# EasyEDA schematic SCH_Padauk_breakout_sop8_2023-01-24.json
TITLE: EZ PDK8; REV: 1.0; Date: 2023-01-24; Sheet: 1/1; Drawn By: Cjacker; Company: TEAM A72
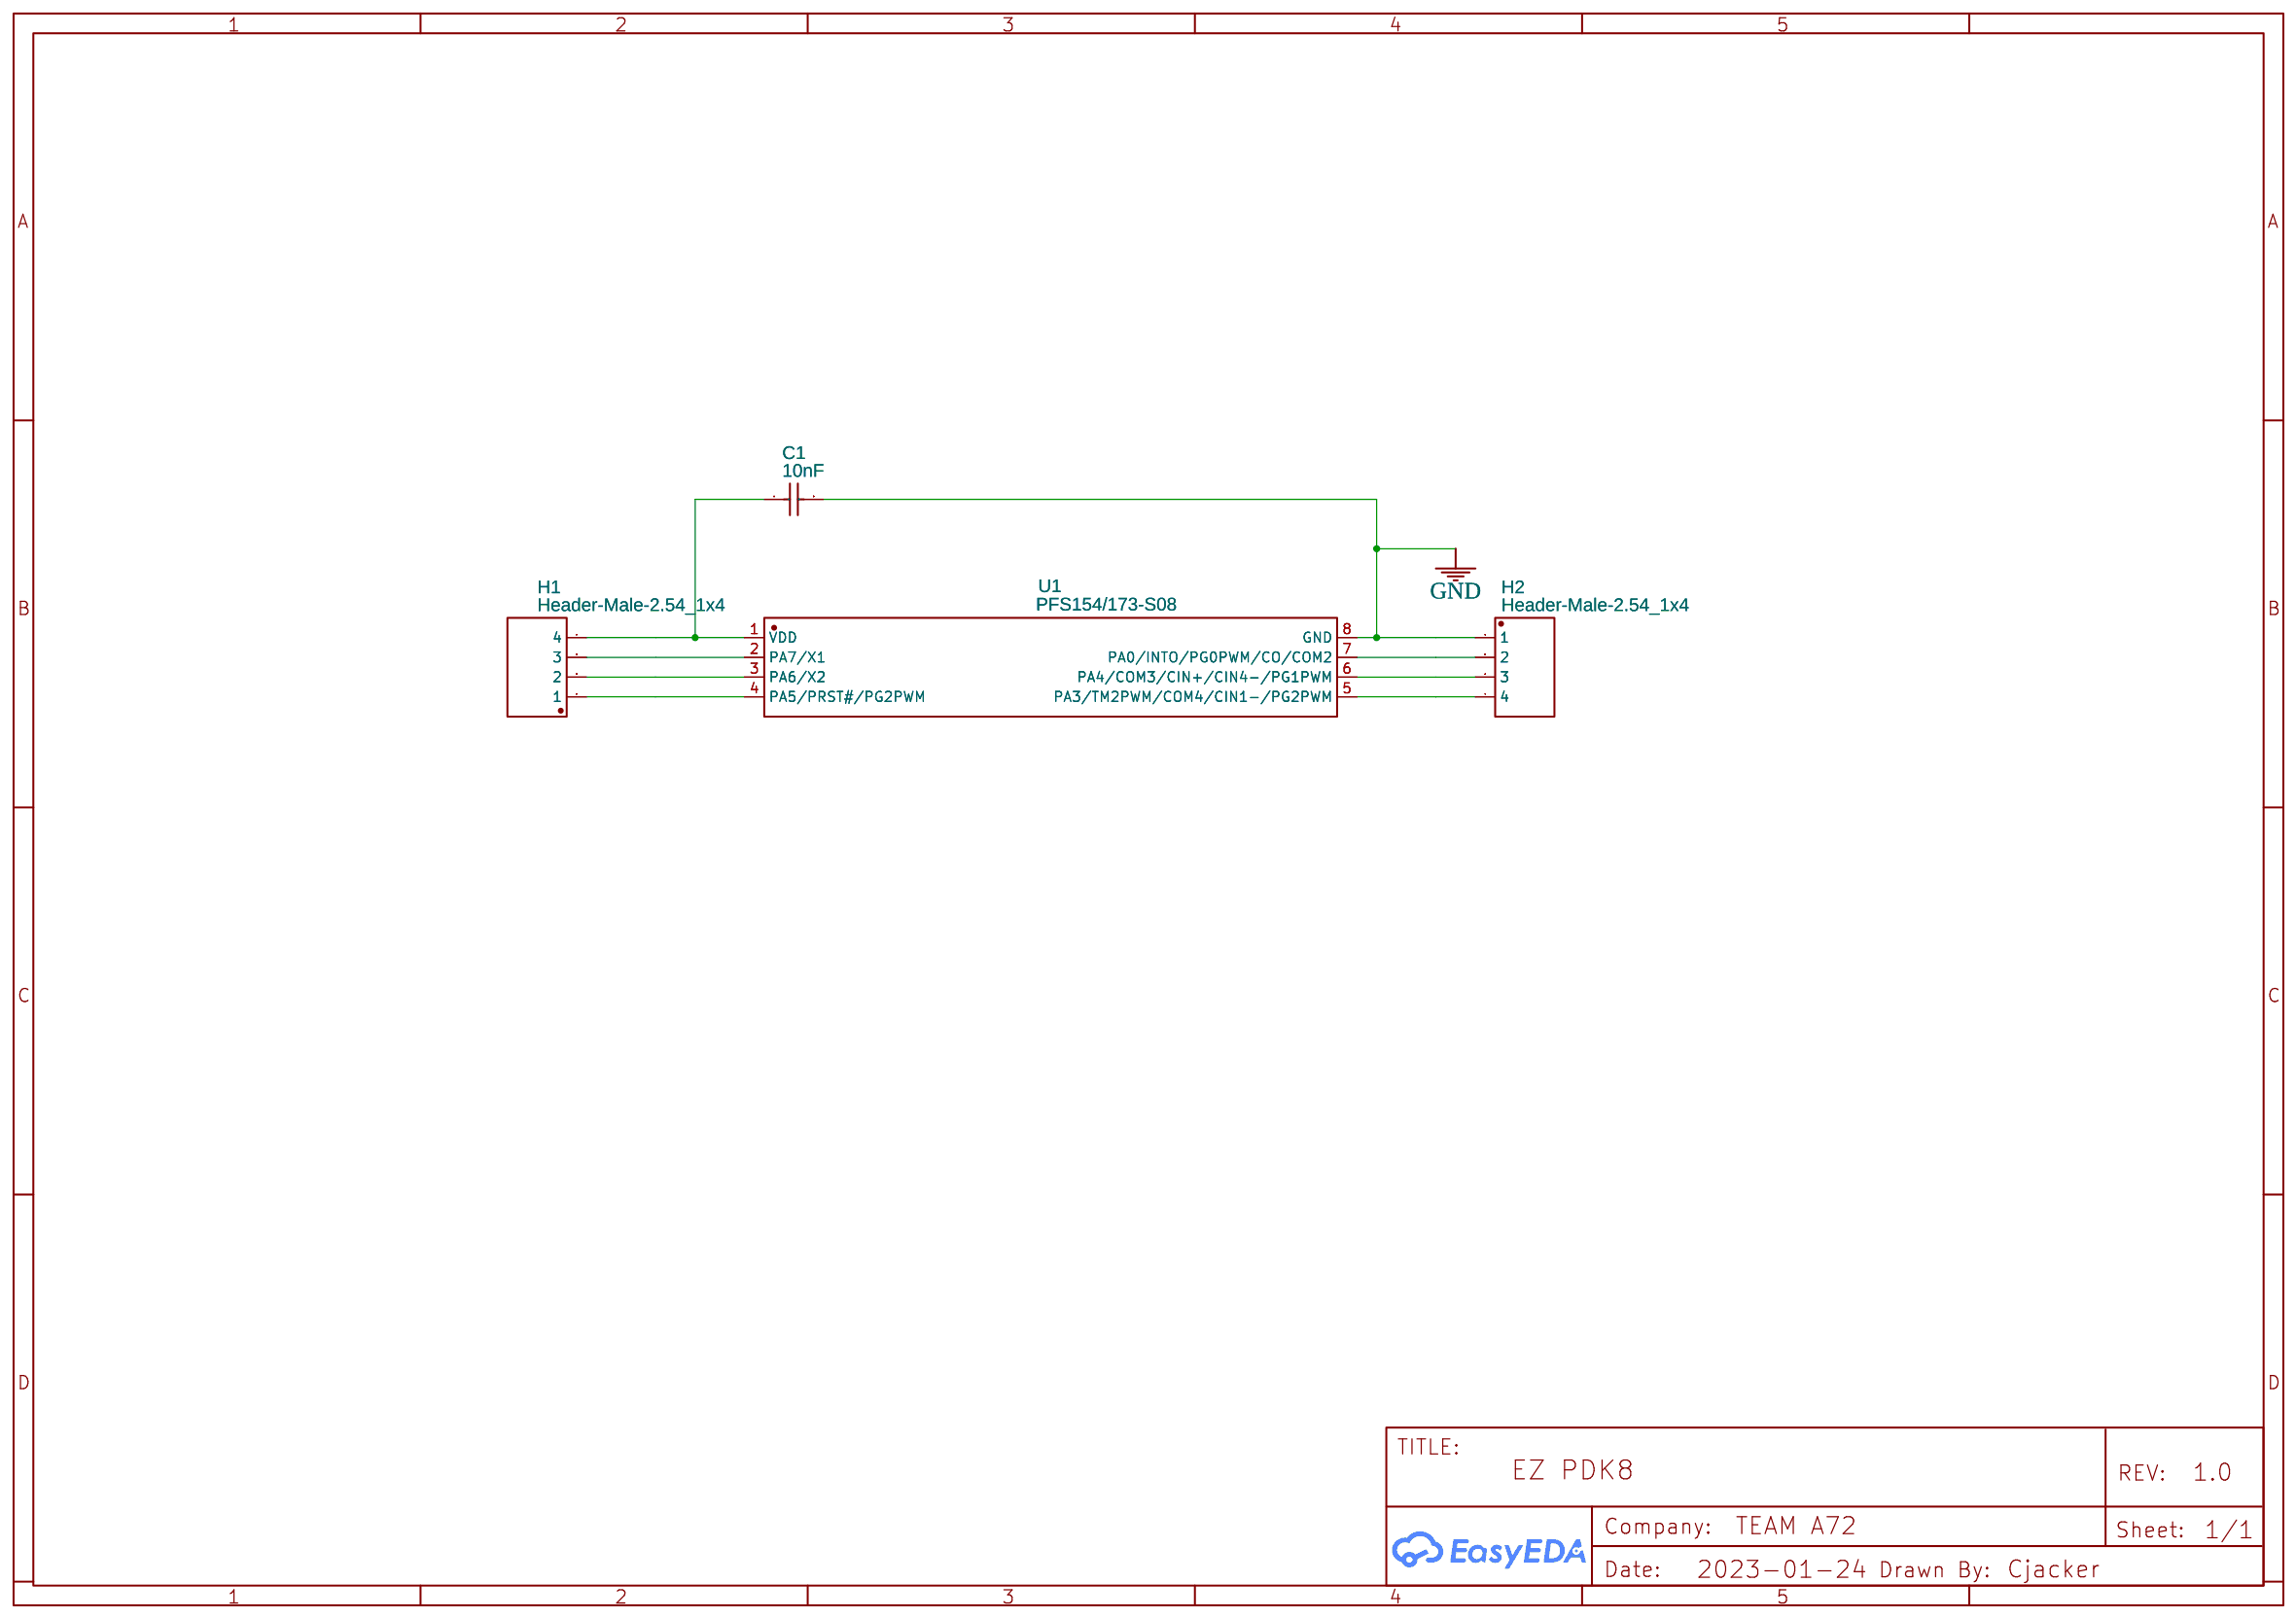
[diagram p0: schematic sheet]

## Parts
C1  10nF  [C0805]
H1  Header-Male-2.54_1x4  [HDR-TH_4P-P2.54-V]
H2  Header-Male-2.54_1x4  [HDR-TH_4P-P2.54-V]
U1  PFS154/173-S08  [SOP-8_L4.9-W3.9-P1.27-LS6.0-BL]

## Library data of the parts
C1 = 0805CG103J500NT: Supplier: LCSC; Manufacturer: FH; Supplier Part: C63849
H1 H2 = Header-Male-2.54_1x4: Supplier: LCSC; Manufacturer: Ckmtw; Manufacturer Part: 210S-1*4P L=11.6MMGold-plated black; Contributor: LCSC; Supplier Part: C124378
U1 = PMS154C-S08: Supplier: LCSC; Supplier Part: C168657; Manufacturer: PADAUK Tech; Contributor: LCSC

## Nets
GND: C1.2 H2.1 U1.8(GND)
Net-(C1-1): C1.1 H1.4 U1.1(VDD)
Net-(H1-1): H1.1 U1.4(PA5/PRST#/PG2PWM)
Net-(H1-2): H1.2 U1.3(PA6/X2)
Net-(H1-3): H1.3 U1.2(PA7/X1)
Net-(H2-2): H2.2 U1.7(PA0/INTO/PG0PWM/CO/COM2)
Net-(H2-3): H2.3 U1.6(PA4/COM3/CIN+/CIN4-/PG1PWM)
Net-(H2-4): H2.4 U1.5(PA3/TM2PWM/COM4/CIN1-/PG2PWM)
